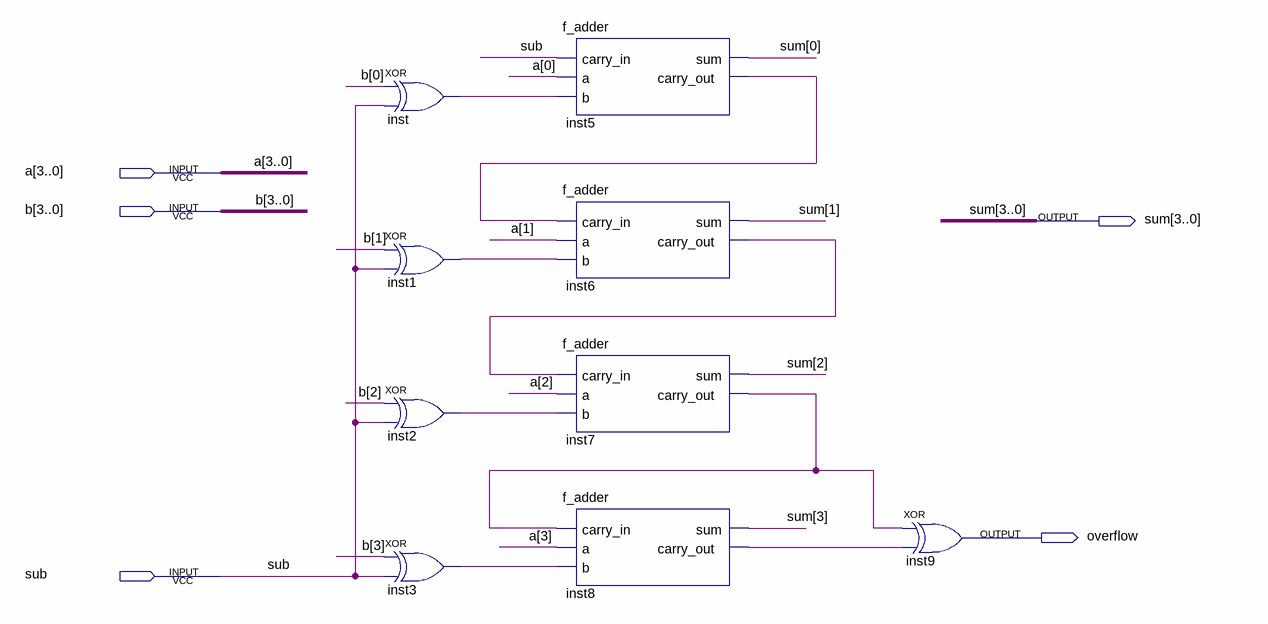
[diagram p0: schematic sheet]
// Quartus schematic add_sub.bdf as structural Verilog: 9 symbols, 5 pins
module add_sub (
  input  [3:0] a,
  input  [3:0] b,
  input  sub,
  output [3:0] sum,
  output overflow
);

  wire inst1_out, inst2_out, inst3_out, inst5_carry_out, inst6_carry_out, inst7_carry_out, inst8_carry_out,
       inst_out;

  xor inst (inst_out, b[0], sub);
  xor inst1 (inst1_out, b[1], sub);
  xor inst2 (inst2_out, b[2], sub);
  xor inst3 (inst3_out, b[3], sub);
  f_adder inst5 (.carry_in(sub), .a(a[0]), .b(inst_out), .sum(sum[0]), .carry_out(inst5_carry_out));
  f_adder inst6 (.carry_in(inst5_carry_out), .a(a[1]), .b(inst1_out), .sum(sum[1]), .carry_out(inst6_carry_out));
  f_adder inst7 (.carry_in(inst6_carry_out), .a(a[2]), .b(inst2_out), .sum(sum[2]), .carry_out(inst7_carry_out));
  f_adder inst8 (.carry_in(inst7_carry_out), .a(a[3]), .b(inst3_out), .sum(sum[3]), .carry_out(inst8_carry_out));
  xor inst9 (overflow, inst7_carry_out, inst8_carry_out);
endmodule
